# Altium schematic sheet 200_Peripherals_Sensors.SchDoc
size A; SheetNumber: 4; SheetTotal: 5
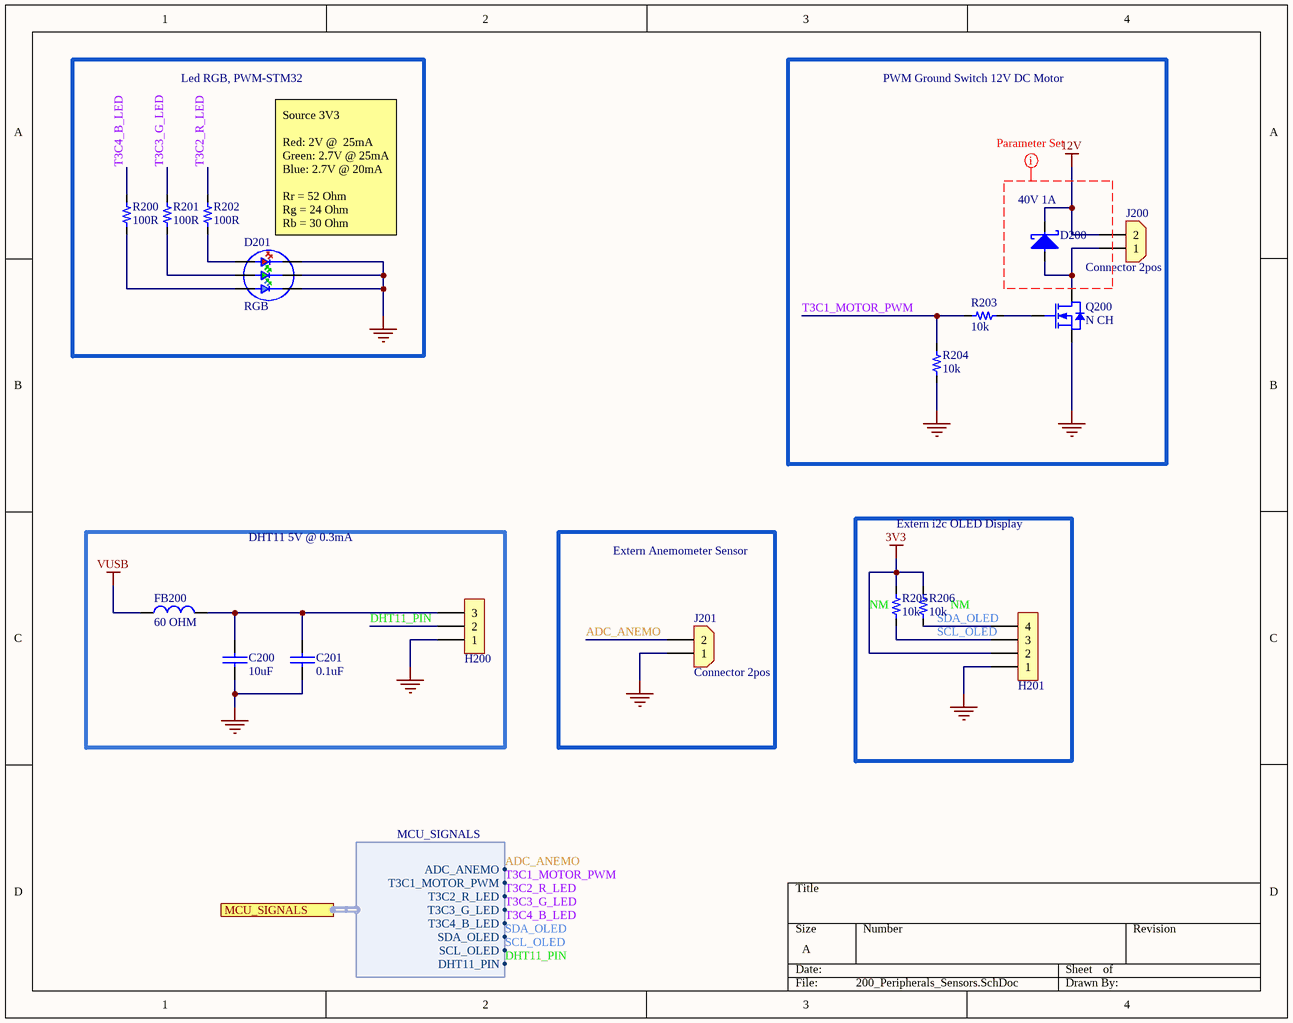
[diagram p0: 200_Peripherals_Sensors.SchDoc]

## Parts
C200  value 10uF  [0805_cap]  (hidden comment: 10uF 25V)
C201  value 0.1uF  [0603_cap]  (hidden comment: 0.1uF 50V)
D200  40V 1A  [SOD_123]
D201  RGB  [RGB_NS_3.5X3.7]
FB200  value 60 OHM  [0603_fb]  (hidden comment: 60OHM 2A)
H200  3x1  [H_3X1_TH_100mil]  (value not drawn)  (no BOM)
H201  4x1  [H_4x1_TH_2.54mm]  (value not drawn)  (no BOM)
J200  Connector 2pos  [CON_2x1_TH_5MM]
J201  Connector 2pos  [CON_2x1_TH_5MM]
Q200  N CH  [SOT_23_3]
R200  value 100R  [0603_res]  (hidden comment: 100R 1/10W)
R201  value 100R  [0603_res]  (hidden comment: 100R 1/10W)
R202  value 100R  [0603_res]  (hidden comment: 100R 1/10W)
R203  value 10k  [0603_res]  (hidden comment: 10k 1/10W)
R204  value 10k  [0603_res]  (hidden comment: 10k 1/10W)
R205  value 10k  Usage: NM  [0603_res]  (hidden comment: 10k 1/10W)
R206  value 10k  Usage: NM  [0603_res]  (hidden comment: 10k 1/10W)

## Blocks framed on the sheet
Led RGB, PWM-STM32: D201 R200-R202
PWM Ground Switch 12V DC Motor: D200 J200 Q200 R203 R204
DHT11 5V @ 0.3mA: C200 C201 FB200 H200
Extern Anemometer Sensor: J201
Extern i2c OLED Display: H201 R205 R206

## Ports
MCU_SIGNALS (harness MCU_SIGNALS, see Main[3B], 000_STM[3D])

## Harnesses
MCU_SIGNALS: ADC_ANEMO, T3C1_MOTOR_PWM, T3C2_R_LED, T3C3_G_LED, T3C4_B_LED, SDA_OLED, SCL_OLED, DHT11_PIN

## Nets
3V3: H201.2 R205.2 R206.2
12V: D200.1 J200.2
GND: C200.2 C201.2 D201.1 D201.2 D201.3 H200.1 H201.1 J201.1 Q200.2(S) R204.1
VUSB: FB200.1
ADC_ANEMO: J201.2 ; port MCU_SIGNALS.ADC_ANEMO
DHT11_PIN: H200.2 ; port MCU_SIGNALS.DHT11_PIN
SCL_OLED: H201.3 R205.1 ; port MCU_SIGNALS.SCL_OLED
SDA_OLED: H201.4 R206.1 ; port MCU_SIGNALS.SDA_OLED
T3C1_MOTOR_PWM: R203.2 R204.2 ; port MCU_SIGNALS.T3C1_MOTOR_PWM
T3C2_R_LED: R202.2 ; port MCU_SIGNALS.T3C2_R_LED
T3C3_G_LED: R201.2 ; port MCU_SIGNALS.T3C3_G_LED
T3C4_B_LED: R200.2 ; port MCU_SIGNALS.T3C4_B_LED
NetC200_1: C200.1 C201.1 FB200.2 H200.3
NetD200_2: D200.2 J200.1 Q200.3(D)
NetD201_4: D201.4 R202.1
NetD201_5: D201.5 R201.1
NetD201_6: D201.6 R200.1
NetQ200_1: Q200.1(G) R203.1

## Layout directives
net class 12V_2A: (no net found under the mark)

## Notes on the sheet
- (near D201) Source 3V3
  Red: 2V @  25mA
  Green: 2.7V @ 25mA
  Blue: 2.7V @ 20mA
  Rr = 52 Ohm
  Rg = 24 Ohm
  Rb = 30 Ohm

## Library data of the parts
C200 = Cap_10uF_0805_25V_: 25V 10uF X5R ±10% 0805 Multilayer Ceramic Capacitors MLCC - SMD/SMT ROHS; Manufacturer: Samsung Electro-Mechanics; Manufacturer Part Number: CL21A106KAYNNNE; Supplier 1: LCSC; Supplier Part Number 1: C15850; ComponentLink1Description: LCSC; ComponentLink1URL: https://lcsc.com/product-detail/Multilayer-Ceramic-Capacitors-MLCC-SMD-SMT_Samsung-Electro-Mechanics-CL21A106KAYNNNE_C15850.html
C201 = Cap_0.1uF_0603_50V: 50V 100nF Y5V -20%~+80% 0603 Multilayer Ceramic Capacitors MLCC - SMD/SMT ROHS; Manufacturer: Walsin Tech Corp; Manufacturer Part Number: 0603F104Z500CT; Supplier 1: LCSC; Supplier Part Number 1: C83060; ComponentLink1Description: LCSC; ComponentLink1URL: https://www.lcsc.com/product-detail/Multilayer-Ceramic-Capacitors-MLCC-SMD-SMT_Walsin-Tech-Corp-0603F104Z500CT_C83060.html
D200 = D_Schottky_40V_1A_SOD_123F: DIODE SCHOTTKY 40V 1A SOD123F; Manufacturer: Shanghai Prisemi Elec; Manufacturer Part Number: PSBD1DF40V1H; Supplier 1: LCSC; Supplier Part Number 1: C110730; ComponentLink1Description: LCSC; ComponentLink1URL: https://www.lcsc.com/product-detail/Switching-Diode_Shanghai-Prisemi-Elec-PSBD1DF40V1H_C110730.html
D201 = LED_RGB_3535_SMD: -30℃~+85℃ RGB 110° 3535(mm) Light Emitting Diodes (LED) ROHS; Manufacturer: Foshan NationStar Optoelectronics; Manufacturer Part Number: RS-3535MWAM; Supplier 1: LCSC; Supplier Part Number 1: C842778; ComponentLink1Description: LCSC; ComponentLink1URL: https://www.lcsc.com/product-detail/Light-Emitting-Diodes-LED_Foshan-NationStar-Optoelectronics-RS-3535MWAM_C842778.html
FB200 = FB_60_0603_2A: 2A 1 100mΩ 60Ω@100MHz ±25% 0603 Ferrite Beads ROHS; Manufacturer: TAI-TECH; Manufacturer Part Number: HCB1608KF-600T20; ComponentLink1Description: LCSC; ComponentLink1URL: https://www.lcsc.com/product-detail/Ferrite-Beads_TAI-TECH-HCB1608KF-600T20_C369516.html; Supplier 1: LCSC; Supplier Part Number 1: C369516
H200 = H_Male_3x1_TH_100mil: ComponentLink1Description: LCSC
H201 = H_Male_4x1_TH_100mil: ComponentLink1Description: LCSC
J200 J201 = Con_2x1_TH_5mm: 2POS 5MM; Manufacturer: JILN; Manufacturer Part Number: JL126-50002G01; Supplier 1: LCSC; Supplier Part Number 1: C394556; ComponentLink1Description: Digi-Key; ComponentLink1URL: https://www.lcsc.com/product-detail/Screw-terminal_JILN-JL126-50002G01_C394556.html
Q200 = Q_NFET_20V_3.2A_SOT23: MOSFET N-CH 20V SOT23; Manufacturer: Doeshare; Manufacturer Part Number: DN2302S; Supplier 1: LCSC; Supplier Part Number 1: C2931750; ComponentLink1Description: LCSC; ComponentLink1URL: https://www.lcsc.com/product-detail/MOSFETs_Doeshare-DN2302S_C2931750.html
R200-R202 = Res_100R_0603_1/10W: RES SMD 100R OHM 5% 1/10W 0603; Manufacturer: FOJAN; Manufacturer Part Number: FRC0603J101 TS; ComponentLink1URL: https://www.lcsc.com/product-detail/Chip-Resistor-Surface-Mount_FOJAN-FRC0603J101-TS_C2907089.html; Supplier 1: LCSC; Supplier Part Number 1: C2907089; ComponentLink1Description: LCSC
R203-R206 = Res_10k_0603_1/10W: RES SMD 10k OHM 5% 1/10W 0603; Manufacturer: FOJAN; Manufacturer Part Number: FRC0603J103TS; ComponentLink1URL: https://www.lcsc.com/product-detail/Chip-Resistor-Surface-Mount_FOJAN-FRC0603J103TS_C2930027.html; Supplier 1: LCSC; Supplier Part Number 1: C2930027; ComponentLink1Description: LCSC